# Altium schematic sheet analogPath.SchDoc
size 381 x 241 mm
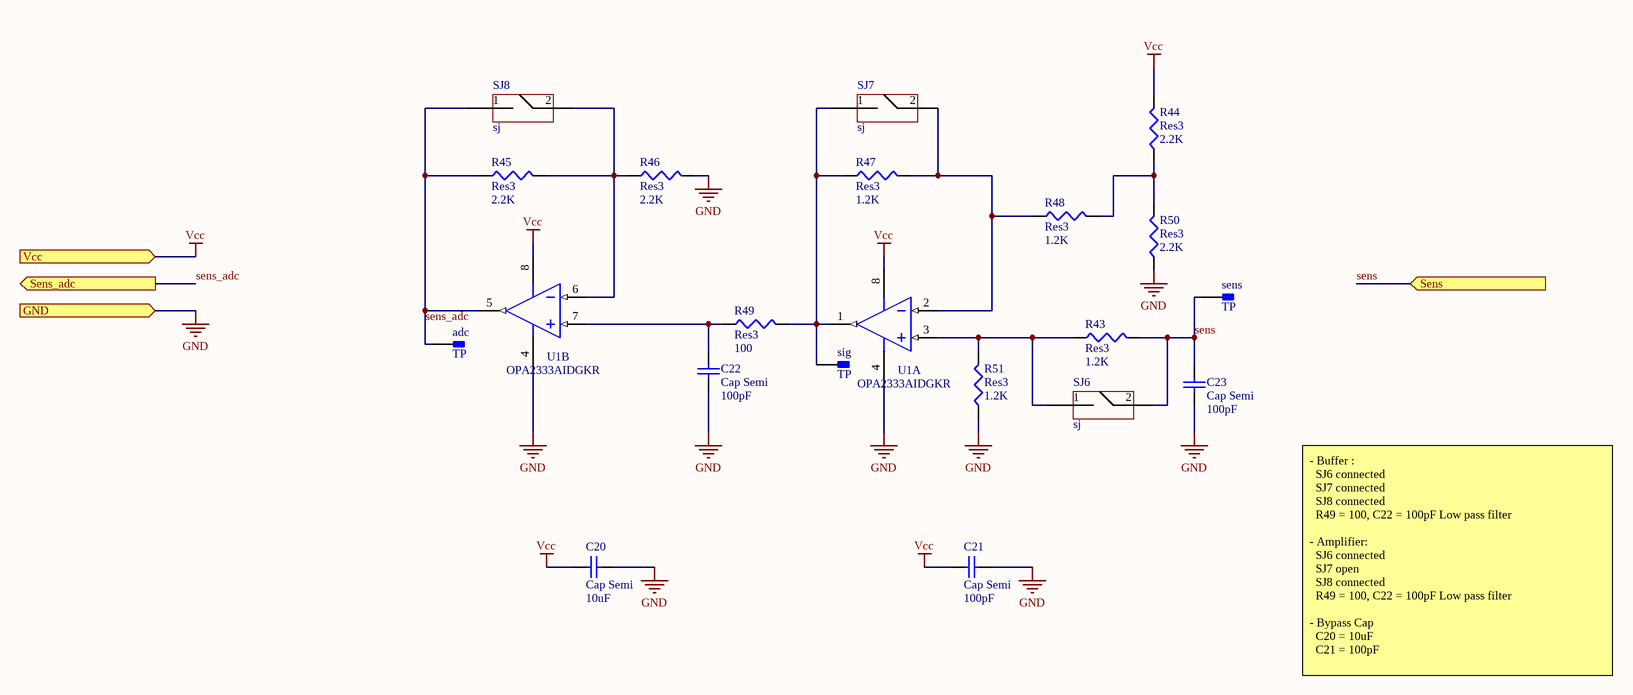
[diagram p0: analogPath.SchDoc]

## Parts
adc  TP  [TP]
C20  Cap Semi  value 10uF  [1608[0603]]
C21  Cap Semi  value 100pF  [1608[0603]]
C22  Cap Semi  value 100pF  [1608[0603]]
C23  Cap Semi  value 100pF  [1608[0603]]
R43  Res3  value 1.2K  [J1-0603]
R44  Res3  value 2.2K  [J1-0603]
R45  Res3  value 2.2K  [J1-0603]
R46  Res3  value 2.2K  [J1-0603]
R47  Res3  value 1.2K  [J1-0603]
R48  Res3  value 1.2K  [J1-0603]
R49  Res3  value 100  [J1-0603]
R50  Res3  value 2.2K  [J1-0603]
R51  Res3  value 1.2K  [J1-0603]
sens  TP  [TP]
sig  TP  [TP]
SJ6  sj  [SJ2]
SJ7  sj  [SJ2]
SJ8  sj  [SJ2]
U1  OPA2333AIDGKR  [MSOP-8]  (parts A,B of 2)

## Ports
GND (in), Sens (in), Sens_adc (out), Vcc (in)

## Nets
GND: C20.1 C21.2 C22.1 C23.1 R46.2 R50.1 R51.1 U1.4(-V) ; port GND
Vcc: C20.2 C21.1 R44.2 U1.8(+V) ; port Vcc
sens: C23.2 R43.2 sens.1 SJ6.2 ; port Sens
sens_adc: adc.1 R45.1 SJ8.1 U1.5(OUT_A) ; port Sens_adc
NetC22_2: C22.2 R49.1 U1.7(+IN_A)
NetR43_1: R43.1 R51.2 SJ6.1 U1.3(+IN_A)
NetR44_1: R44.1 R48.2 R50.2
NetR45_2: R45.2 R46.1 SJ8.2 U1.6(-IN_A)
NetR47_1: R47.1 R49.2 sig.1 SJ7.1 U1.1(OUT_A)
NetR47_2: R47.2 R48.1 SJ7.2 U1.2(-IN_A)

## Notes on the sheet
- - Buffer :
  SJ6 connected
  SJ7 connected
  SJ8 connected
  R49 = 100, C22 = 100pF Low pass filter
  - Amplifier:
  SJ6 connected
  SJ7 open
  SJ8 connected
  R49 = 100, C22 = 100pF Low pass filter
  - Bypass Cap
  C20 = 10uF
  C21 = 100pF

## Library data of the parts
adc sens sig = TP: Solder test point
C20 = Cap Semi: Capacitor (Semiconductor SIM Model); Manufacturer: Samsung Electro-Mechanics; Manufacturer Part Number: CL10A106MQ8NNNC; Published: 8-Jun-2000; LatestRevisionDate: 29-May-2009; LatestRevisionNote: IPC-7351 Footprint Added.; PackageReference: C1206; Publisher: Altium Limited; PackageDescription: Chip Capacitor; Supplier 1: LCSC; Supplier Part Number 1: C1691
C21-C23 = Cap Semi: Capacitor (Semiconductor SIM Model); Manufacturer: YAGEO; Manufacturer Part Number: CC0603KRX7R8BB101; Published: 8-Jun-2000; LatestRevisionDate: 29-May-2009; LatestRevisionNote: IPC-7351 Footprint Added.; PackageReference: C0603; Publisher: Altium Limited; PackageDescription: Chip Capacitor; Supplier 1: LCSC; Supplier Part Number 1: C519410
R43 R47 R48 R51 = Res3: Resistor; Manufacturer Part Number: MCR03EZPFX1201; Manufacturer: ROHM Semicon; Published: 8-Jun-2000; LatestRevisionDate: 29-May-2009; LatestRevisionNote: IPC-7351 Footprint Added.; PackageReference: J1-0603; Publisher: Altium Limited; PackageDescription: Chip Resistor; Supplier Part Number 1: C380376; Supplier 1: LCSC
R44-R46 R50 = Res3: Resistor; Manufacturer Part Number: RC0603FR-072K2L; Manufacturer: YAGEO; Published: 8-Jun-2000; LatestRevisionDate: 29-May-2009; LatestRevisionNote: IPC-7351 Footprint Added.; PackageReference: J1-0603; Publisher: Altium Limited; PackageDescription: Chip Resistor; Supplier 1: LCSC; Supplier Part Number 1: C114662
R49 = Res3: Resistor; Manufacturer Part Number: RC0603FR-07100RL; Manufacturer: YAGEO; Published: 8-Jun-2000; LatestRevisionDate: 29-May-2009; LatestRevisionNote: IPC-7351 Footprint Added.; PackageReference: J1-0603; Publisher: Altium Limited; PackageDescription: Chip Resistor; Supplier 1: LCSC; Supplier Part Number 1: C105588
SJ6-SJ8 = Jumper: solder jumper generic
U1 = OPA2333: Precision OpAmps Zero-Drift 2 1.8V ~ 5.5V, ±0.9V ~ 2.75V 350kHz 0.16 V/us MSOP-8 RoHS; Manufacturer: Texas Instruments; Supplier 1: LCSC; Supplier Part Number 1: C19608; Manufacturer Part Number: OPA2333AIDGKR